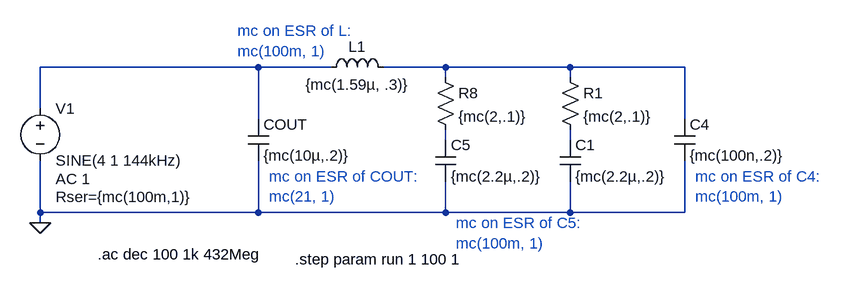
[diagram p0: schematic Draft2.asc]
Draft2.asc, the LTspice schematic file:
Version 4
SHEET 1 1080 680
WIRE 208 48 -128 48
WIRE 320 48 208 48
WIRE 496 48 400 48
WIRE 688 48 496 48
WIRE 864 48 688 48
WIRE 496 64 496 48
WIRE 688 64 688 48
WIRE -128 112 -128 48
WIRE 208 128 208 48
WIRE 864 128 864 48
WIRE 496 160 496 144
WIRE 688 160 688 144
WIRE -128 272 -128 192
WIRE 208 272 208 192
WIRE 208 272 -128 272
WIRE 496 272 496 224
WIRE 496 272 208 272
WIRE 688 272 688 224
WIRE 688 272 496 272
WIRE 864 272 864 192
WIRE 864 272 688 272
WIRE -128 288 -128 272
FLAG -128 288 0
SYMBOL voltage -128 96 R0
WINDOW 123 24 124 Left 2
WINDOW 39 24 152 Left 2
SYMATTR InstName V1
SYMATTR Value SINE(4 1 144kHz)
SYMATTR Value2 AC 1
SYMATTR SpiceLine Rser={mc(100m,1)}
SYMBOL ind 304 64 R270
WINDOW 0 32 56 VTop 2
WINDOW 3 5 56 VBottom 2
SYMATTR InstName L1
SYMATTR Value {mc(1.59µ, .3)}
SYMATTR SpiceLine Ipk=2 Rser={mc(100m,1)}
SYMBOL res 480 48 R0
SYMATTR InstName R8
SYMATTR Value {mc(2,.1)}
SYMBOL cap 192 128 R0
SYMATTR InstName COUT
SYMATTR Value {mc(10µ,.2)}
SYMATTR SpiceLine Rser={mc(21,1)}
SYMBOL cap 480 160 R0
SYMATTR InstName C5
SYMATTR Value {mc(2.2µ,.2)}
SYMATTR SpiceLine Rser={mc(100m,1)}
SYMBOL cap 848 128 R0
SYMATTR InstName C4
SYMATTR Value {mc(100n,.2)}
SYMATTR SpiceLine Rser={mc(100m,1)}
SYMBOL cap 672 160 R0
SYMATTR InstName C1
SYMATTR Value {mc(2.2µ,.2)}
SYMATTR SpiceLine Rser={mc(100m,1)}
SYMBOL res 672 48 R0
SYMATTR InstName R1
SYMATTR Value {mc(2,.1)}
TEXT -40 336 Left 2 !.ac dec 100 1k 432Meg
TEXT 176 -8 Left 2 ;mc on ESR of L:\nmc(100m, 1)
TEXT 224 216 Left 2 ;mc on ESR of COUT:\nmc(21, 1)
TEXT 512 288 Left 2 ;mc on ESR of C5:\nmc(100m, 1)
TEXT 880 216 Left 2 ;mc on ESR of C4:\nmc(100m, 1)
TEXT 264 344 Left 2 !.step param run 1 100 1

The netlist it stands for:
* Draft2.asc
V1 N001 0 SINE(4 1 144kHz) AC 1 Rser={mc(100m,1)}
L1 N001 N002 {mc(1.59µ, .3)} Ipk=2 Rser={mc(100m,1)}
R8 N002 N003 {mc(2,.1)}
COUT N001 0 {mc(10µ,.2)} Rser={mc(21,1)}
C5 N003 0 {mc(2.2µ,.2)} Rser={mc(100m,1)}
C4 N002 0 {mc(100n,.2)} Rser={mc(100m,1)}
C1 N004 0 {mc(2.2µ,.2)} Rser={mc(100m,1)}
R1 N002 N004 {mc(2,.1)}
.ac dec 100 1k 432Meg
* mc on ESR of L:
* mc(100m, 1)
* mc on ESR of COUT:
* mc(21, 1)
* mc on ESR of C5:
* mc(100m, 1)
* mc on ESR of C4:
* mc(100m, 1)
.step param run 1 100 1
.backanno
.end